# EAGLE design Base (EAGLE 9.5.2)
CNAME: WindowController; CREVISION: 0.9; DESIGNER: Bastian Teßin
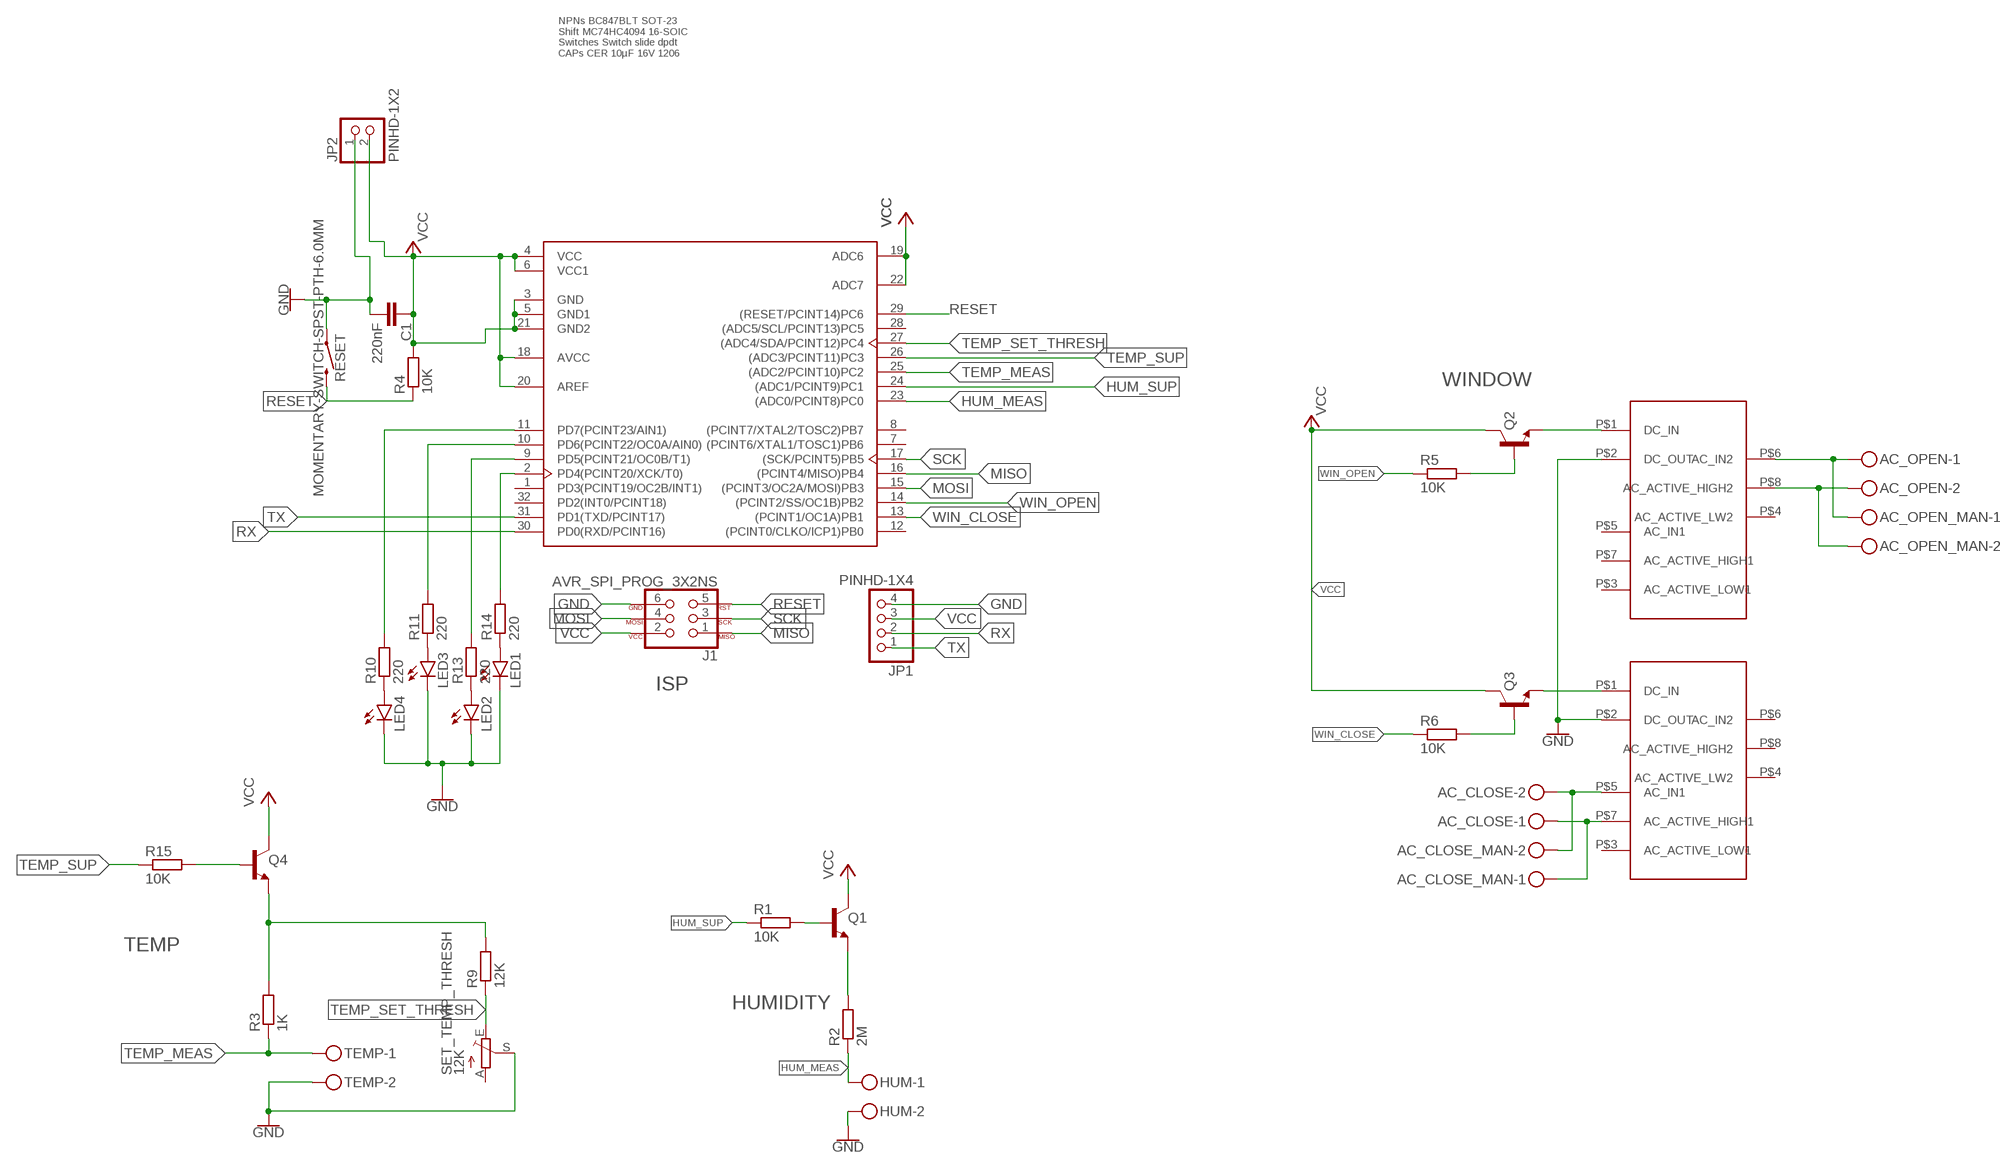
[diagram p0: schematic, sheet 1]

## Parts
AC_CLOSE  MKDSN1,5/2-5,08  [MKDSN1,5/2-5,08]
AC_CLOSE_MAN  MKDSN1,5/2-5,08  [MKDSN1,5/2-5,08]
AC_OPEN  MKDSN1,5/2-5,08  [MKDSN1,5/2-5,08]
AC_OPEN_MAN  MKDSN1,5/2-5,08  [MKDSN1,5/2-5,08]
C1  220nF  C-EUC0805  [C0805]
HUM  MKDSN1,5/2-5,08  [MKDSN1,5/2-5,08]
J1  AVR_SPI_PROG_3X2NS  [2X3-NS]
JP1  PINHD-1X4  [1X04]
JP2  PINHD-1X2  [1X02]
LED1  LEDSMT1206  [1206]
LED2  LEDSMT1206  [1206]
LED3  LEDSMT1206  [1206]
LED4  LEDSMT1206  [1206]
Q1  BD139  BC847BLT1-NPN-SOT23-BEC  [SOT23-BEC]
Q2  BD139  BC847BLT1-NPN-SOT23-BEC  [SOT23-BEC]
Q3  BD139  BC847BLT1-NPN-SOT23-BEC  [SOT23-BEC]
Q4  BD139  BC847BLT1-NPN-SOT23-BEC  [SOT23-BEC]
R1  10K  R-EU_R1206  [R1206]
R2  2M  R-EU_R1206  [R1206]
R3  1K  R-EU_R1206  [R1206]
R4  10K  R-EU_R1206  [R1206]
R5  10K  R-EU_R1206  [R1206]
R6  10K  R-EU_R1206  [R1206]
R9  12K  R-EU_R1206  [R1206]
R10  220  R-EU_R1206  [R1206]
R11  220  R-EU_R1206  [R1206]
R13  220  R-EU_R1206  [R1206]
R14  220  R-EU_R1206  [R1206]
R15  10K  R-EU_R1206  [R1206]
RESET  MOMENTARY-SWITCH-SPST-PTH-6.0MM  [TACTILE_SWITCH_PTH_6.0MM]
SET_TEMP_THRESH  12K  TRIM_EU-LI15  [LI15]
TEMP  MKDSN1,5/2-5,08  [MKDSN1,5/2-5,08]
U2  ATMEGA328P-AU  [TQFP-32]
U$1  RELAIS_EAG  [REALAIS_EAG]
U$2  RELAIS_EAG  [REALAIS_EAG]

## Nets
GND: C1.2 HUM.2 J1.6 JP1.4 JP2.1 LED1.C LED2.C LED3.C LED4.C RESET.1 SET_TEMP_THRESH.S TEMP.2 U$1.P$2(DC_OUT) U$2.P$2(DC_OUT)
HUM_MEAS: HUM.1 R2.1 U2.23((ADC0/PCINT8)PC0)
HUM_SUP: R1.1 U2.24((ADC1/PCINT9)PC1)
MISO: J1.1 U2.16((PCINT4/MISO)PB4)
MOSI: J1.4 U2.15((PCINT3/OC2A/MOSI)PB3)
N$1: Q1.B R1.2
N$2: Q1.E R2.2
N$3: AC_CLOSE.2 AC_CLOSE_MAN.2 U$2.P$5(AC_IN1)
N$4: Q2.E U$1.P$1(DC_IN)
N$6: Q3.E U$2.P$1(DC_IN)
N$7: AC_OPEN.2 AC_OPEN_MAN.2 U$1.P$8(AC_ACTIVE_HIGH2)
N$8: AC_OPEN.1 AC_OPEN_MAN.1 U$1.P$6(AC_IN2)
N$9: LED4.A R10.1
N$11: Q3.B R6.2
N$12: Q4.E R3.2 R9.2
N$13: LED3.A R11.1
N$14: AC_CLOSE.1 AC_CLOSE_MAN.1 U$2.P$7(AC_ACTIVE_HIGH1)
N$15: LED2.A R13.1
N$16: LED1.A R14.1
N$17: R14.2 U2.2(PD4(PCINT20/XCK/T0))
N$18: R13.2 U2.9(PD5(PCINT21/OC0B/T1))
N$19: R11.2 U2.10(PD6(PCINT22/OC0A/AIN0))
N$20: R10.2 U2.11(PD7(PCINT23/AIN1))
RESET: J1.5 R4.1 RESET.3 U2.29((RESET/PCINT14)PC6)
RX: JP1.2 U2.30(PD0(RXD/PCINT16))
SCK: J1.3 U2.17((SCK/PCINT5)PB5)
TEMP_MEAS: R3.1 TEMP.1 U2.25((ADC2/PCINT10)PC2)
TEMP_SET_THRESH: R9.1 SET_TEMP_THRESH.E U2.27((ADC4/SDA/PCINT12)PC4)
TEMP_SU: Q4.B R15.2
TEMP_SUP: R15.1 U2.26((ADC3/PCINT11)PC3)
TX: JP1.1 U2.31(PD1(TXD/PCINT17))
VCC: C1.1 J1.2 JP1.3 JP2.2 Q1.C Q2.C Q3.C Q4.C R4.2 U2.3(GND) U2.4(VCC) U2.5(GND1) U2.6(VCC1) U2.18(AVCC) U2.19(ADC6) U2.20(AREF) U2.21(GND2) U2.22(ADC7)
WIN_CLOSE: R6.1 U2.13((PCINT1/OC1A)PB1)
WIN_O: Q2.B R5.2
WIN_OPEN: R5.1 U2.14((PCINT2/SS/OC1B)PB2)
Unconnected: SET_TEMP_THRESH.A U2.1(PD3(PCINT19/OC2B/INT1)) U2.7((PCINT6/XTAL1/TOSC1)PB6) U2.8((PCINT7/XTAL2/TOSC2)PB7) U2.12((PCINT0/CLKO/ICP1)PB0) U2.28((ADC5/SCL/PCINT13)PC5) U2.32(PD2(INT0/PCINT18)) U$1.P$3(AC_ACTIVE_LOW1) U$1.P$4(AC_ACTIVE_LW2) U$1.P$5(AC_IN1) U$1.P$7(AC_ACTIVE_HIGH1) U$2.P$3(AC_ACTIVE_LOW1) U$2.P$4(AC_ACTIVE_LW2) U$2.P$6(AC_IN2) U$2.P$8(AC_ACTIVE_HIGH2)

## Notes on the sheet
- NPNs BC847BLT SOT-23
  Shift MC74HC4094 16-SOIC
  Switches Switch slide dpdt 
  CAPs CER 10µF 16V 1206
- WINDOW
- ISP
- TEMP
- HUMIDITY

## Library data of the parts
AC_CLOSE AC_CLOSE_MAN AC_OPEN AC_OPEN_MAN HUM TEMP = con-phoenix-508:MKDSN1,5/2-5,08: MKDSN 1,5/ 2-5,08 Printklemme Nennstrom: 13,5 A Nennspannung: 250 V Rastermaß: 5,08 mm Polzahl: 2 Anschlussart: Schraubanschluss Montage: Löten Anschlussrichtung Leiter/Platine: 0 ° Artikelnummer: 1729128 Source: http://eshop.phoenixcontact.com .. 1729128.pdf
C1 = rcl:C-EU: CAPACITOR, European symbol; SPICEPREFIX: C
J1 = SparkFun-Connectors:AVR_SPI_PROG_3X2: AVR ISP 6 Pin This is the reduced ISP connector for AVR programming. Common on Arduino. This footprint will take up less PCB space and can be used with a 10-pin to 6-pin adapter such as SKU: BOB-08508 **Special note about "TEST_POINT" package. The stop mask is on the top side, so if you want your programming test points to be on the bottom of your board, make sure to place this package on the bottom side of the board. This also ensure that the orientation to program from the bottom side will be correct. SparkFun Products: SparkFun ISP Pogo Adapter <https://www.sparkfun.com/products/11591> - NS Tiny AVR Programmer <https://www.sparkfun.com/products/11801> -PTH
JP1 = Connector:PINHD-1X4: PIN HEADER; CATEGORY: CONNECTOR; SUB-CATEGORY: PIN-HEADER
JP2 = Connector:PINHD-1X2: PIN HEADER; CATEGORY: CONNECTOR; SUB-CATEGORY: PIN-HEADER
LED1-LED4 = led:LED: LED OSRAM: - CHIPLED LG R971, LG N971, LY N971, LG Q971, LY Q971, LO R971, LY R971 LH N974, LH R974 LS Q976, LO Q976, LY Q976 LO Q996 - Hyper CHIPLED LW Q18S LB Q993, LB Q99A, LB R99A - SideLED LS A670, LO A670, LY A670, LG A670, LP A670 LB A673, LV A673, LT A673, LW A673 LH A674 LY A675 LS A676, LA A676, LO A676, LY A676, LW A676 LS A679, LY A679, LG A679 - Hyper Micro SIDELED® LS Y876, LA Y876, LO Y876, LY Y876 LT Y87S - SmartLED LW L88C, LW L88S LB L89C, LB L89S, LG L890 LS L89K, LO L89K, LY L89K LS L896, LA L896, LO L896, LY L896 - TOPLED LS T670, LO T670, LY T670, LG T670, LP T670 LSG T670, LSP T670, LSY T670, LOP T670, LYG T670 LG T671, LOG T671, LSG T671 LB T673, LV T673, LT T673, LW T673 LH T674 LS T676, LA T676, LO T676, LY T676, LB T676, LH T676, LSB T676, LW T676 LB T67C, LV T67C, LT T67C, LS T67K, LO T67K, LY T67K, LW E67C LS E67B, LA E67B, LO E67B, LY E67B, LB E67C, LV E67C, LT E67C LW T67C LS T679, LY T679, LG T679 LS T770, LO T770, LY T770, LG T770, LP T770 LB T773, LV T773, LT T773, LW T773 LH T774 LS E675, LA E675, LY E675, LS T675 LS T776, LA T776, LO T776, LY T776, LB T776 LHGB T686 LT T68C, LB T68C - Hyper Mini TOPLED® LB M676 - Mini TOPLED Santana® LG M470 LS M47K, LO M47K, LY M47K Source: http://www.osram.convergy.de LUXEON: - LUMILED® LXK2-PW12-R00, LXK2-PW12-S00, LXK2-PW14-U00, LXK2-PW14-V00 LXK2-PM12-R00, LXK2-PM12-S00, LXK2-PM14-U00 LXK2-PE12-Q00, LXK2-PE12-R00, LXK2-PE12-S00, LXK2-PE14-T00, LXK2-PE14-U00 LXK2-PB12-K00, LXK2-PB12-L00, LXK2-PB12-M00, LXK2-PB14-N00, LXK2-PB14-P00, LXK2-PB14-Q00 LXK2-PR12-L00, LXK2-PR12-M00, LXK2-PR14-Q00, LXK2-PR14-R00 LXK2-PD12-Q00, LXK2-PD12-R00, LXK2-PD12-S00 LXK2-PH12-R00, LXK2-PH12-S00 LXK2-PL12-P00, LXK2-PL12-Q00, LXK2-PL12-R00 Source: www.luxeon.com KINGBRIGHT: KA-3528ASYC Source: www.kingbright.com
Q1-Q4 = transistor:*-NPN-: NPN Transistror BF959 corrected 2008.03.06
R1-R6 R9-R11 R13-R15 = rcl:R-EU_: RESISTOR, European symbol; SPICEPREFIX: R
RESET = SparkFun-Switches:MOMENTARY-SWITCH-SPST: Momentary Switch (Pushbutton) - SPST Normally-open (NO) SPST momentary switches (buttons, pushbuttons). Variants PTH-12MM - 12mm square, through-hole Momentary Pushbutton Switch - 12mm Square <https://www.sparkfun.com/products/9190> (COM-09190) PTH-6.0MM, PTH-6.0MM-KIT - 6.0mm square, through-hole Mini Pushbutton Switch <https://www.sparkfun.com/products/97> (COM-00097) KIT package intended for soldering kit's - only one side of pads' copper is exposed. PTH-RIGHT-ANGLE-KIT - Right-angle, through-hole Right Angle Tactile Button <https://www.sparkfun.com/products/10791> - Used on SparkFun BigTime Watch Kit <https://www.sparkfun.com/products/11734> SMD-12MM - 12mm square, surface-mount Tactile Button - SMD (12mm) <https://www.sparkfun.com/products/12993> (COM-12993) Used on SparkFun PicoBoard <https://www.sparkfun.com/products/11888> SMD-4.5MM - 4.5mm Square Trackball Switch Used on SparkFun Blackberry Trackballer Breakout <https://www.sparkfun.com/products/13169> SMD-4.6MMX2.8MM - 4.60mm x 2.80mm, surface mount Used on SparkFun SAMD21 Mini Breakout <https://www.sparkfun.com/products/13664> SMD-5.2MM, SMD-5.2-REDUNDANT - 5.2mm square, surface-mount Mini Pushbutton Switch - SMD <https://www.sparkfun.com/products/8720> (COM-08720) Used on Arduino Pro Mini <https://www.sparkfun.com/products/11114> REDUNDANT package connects both switch circuits together SMD-6.0X3.5MM - 6.0 x 3.5mm, surface mount Momentary Reset Switch SMD <https://www.sparkfun.com/products/8229> (COM-08229) SMD-6.2MM-TALL - 6.2mm square, surface mount Tactile Button - SMD (6mm) <https://www.sparkfun.com/products/12992> Used on SparkFun Digital Sandbox <https://www.sparkfun.com/products/12651> SMD-RIGHT-ANGLE - Right-angle, surface mount Used on SparkFun Block for Intel® Edison - Arduino <https://www.sparkfun.com/products/13036>; PROD_ID: SWCH-08441; SF_SKU: COM-00097
SET_TEMP_THRESH = pot:TRIM_EU-: POTENTIOMETER
U2 = Microcontroller:ATMEGA328P-AU: IC MCU 8BIT 32KB FLASH 32TQFP Manufacturer's datasheet <http://ww1.microchip.com/downloads/en/DeviceDoc/ATmega48A-PA-88A-PA-168A-PA-328-P-DS-DS40002061A.pdf>; CREATED_BY: PCBLayout.com; DIGIKEY_PART_NUMBER: ATMEGA328P-AU-ND; MANUFACTURER: Microchip Technology; MPN: ATMEGA328P-AU; PACKAGE: TQFP-32
U$1 U$2 = EAG_RELAIS:RELAIS_EAG

## Board
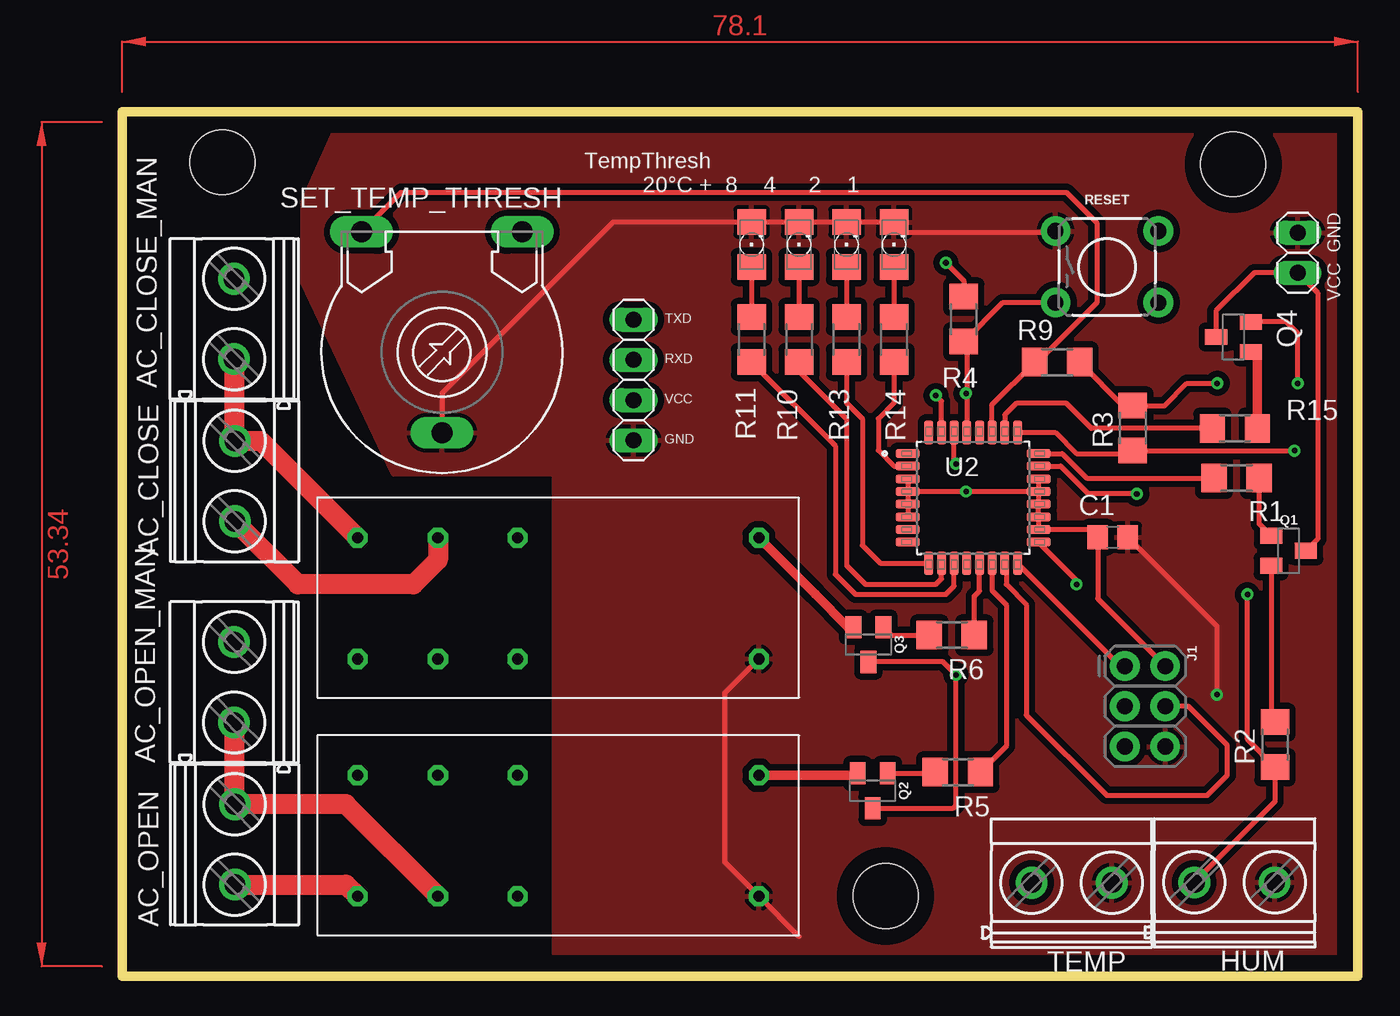
[diagram p1: board, top side]
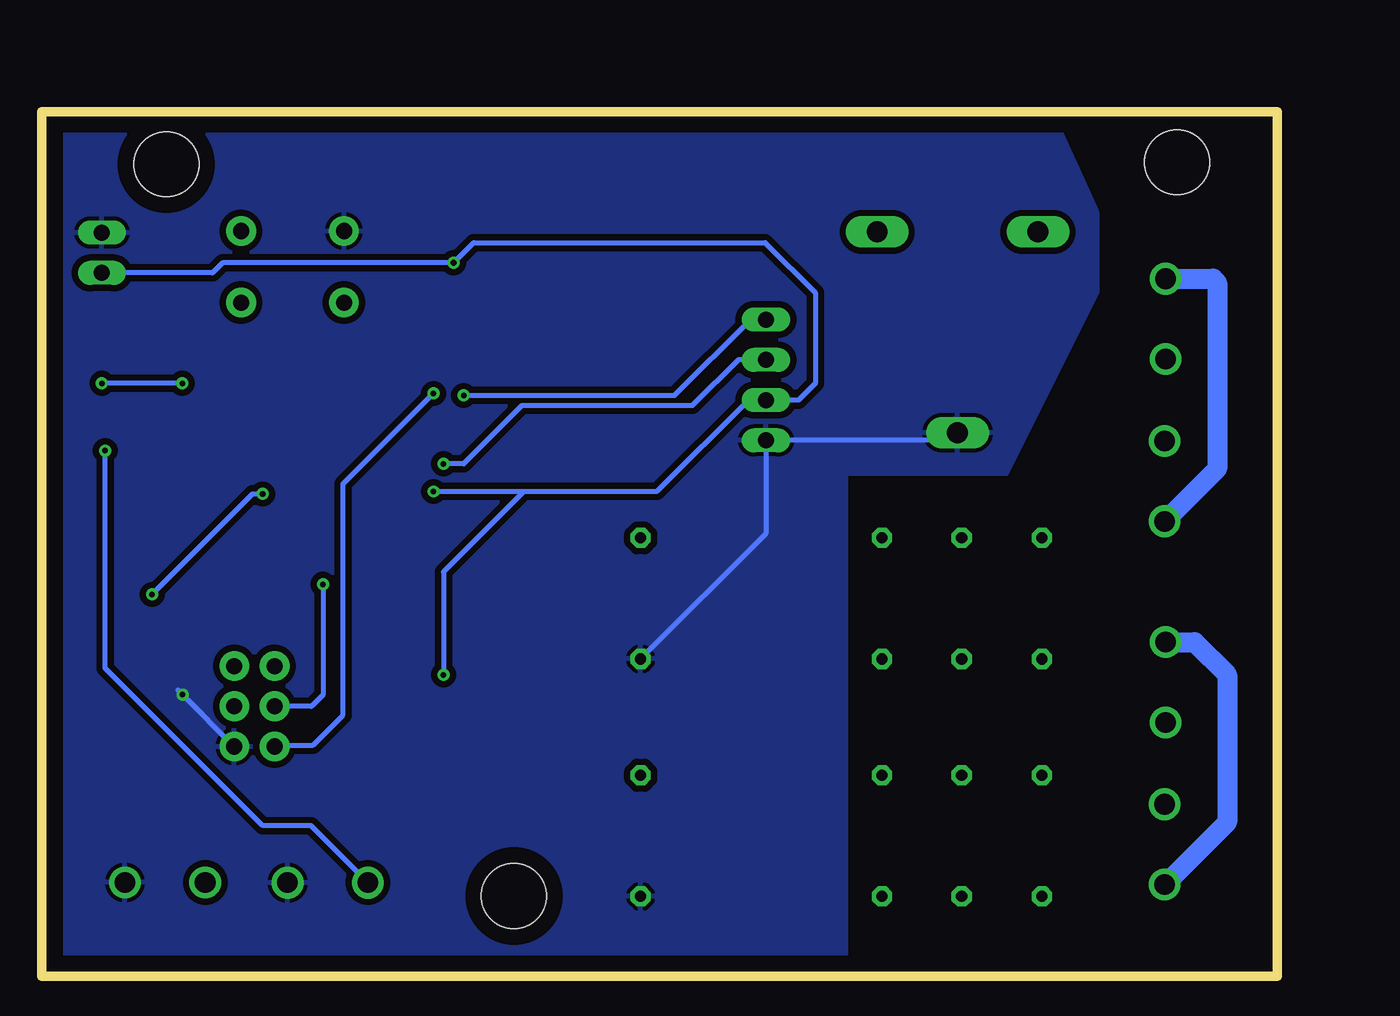
[diagram p2: board, bottom side, seen from below]

Size 78.1 x 54.61 mm. Coordinates in mm from the lower left corner, seen from the top.
Outline: 78.1,0 0,0 0,54.61 78.1,54.61 78.1,0
Copper layers (1*16): Top 0.035mm / dielectric 0.15mm / Bottom 0.035mm
Design rules "default": minimum track width 6mil, minimum drill 0.35mm, track to track 6mil, track to pad 6mil, pad to pad 6mil, via to via 6mil, smd to smd 6mil, copper to edge 40mil, drill to drill 6mil, minimum pad ring 10mil, minimum via ring 8mil, stop-mask expansion 4mil, vias tented up to drill 0mil, thermal gap 10mil
Holes 4.1 mm at 6.35,51.44 70.23,51.31 48.26,5.08

### Footprints (pad centres in the part's own frame; a part is rotated, then mirrored left to right if it is on the bottom)
MKDSN1,5/2-5,08 = drill 1.3 pad 2: 1 -2.561,0.025; 2 2.519,0.025
C0805 = smd 1.3 x 1.5: 1 -0.95,0; 2 0.95,0
2X3-NS = drill 1.016 pad 1.88: 1 -2.54,-1.27; 2 -2.54,1.27; 3 0,-1.27; 4 0,1.27; 5 2.54,-1.27; 6 2.54,1.27
1X04 = drill 1.016 long: 1 -3.81,0; 2 -1.27,0; 3 1.27,0; 4 3.81,0
1X02 = drill 1.016 long: 1 -1.27,0; 2 1.27,0
1206 = smd 1.6 x 1.803: A -1.422,0; C 1.422,0
SOT23-BEC = smd 1 x 1.4: B -0.95,-1.1; C 0,1.1; E 0.95,-1.1
R1206 = smd 1.6 x 1.803: 1 -1.422,0; 2 1.422,0
TACTILE_SWITCH_PTH_6.0MM = drill 1.016 pad 1.88: 1 -3.251,2.261; 2 3.251,2.261; 3 -3.251,-2.261; 4 3.251,-2.261
LI15 = drill 1.321 long: A -5.08,-7.62; E 5.08,-7.62; S 0,5.08
TQFP-32 = smd 0.57 x 1.5: 1 -2.8,-4.13; 2 -2,-4.13; 3 -1.2,-4.13; 4 -0.4,-4.13; 5 0.4,-4.13; 6 1.2,-4.13; 7 2,-4.13; 8 2.8,-4.13; 17 2.8,4.13; 18 2,4.13; 19 1.2,4.13; 20 0.4,4.13; 21 -0.4,4.13; 22 -1.2,4.13; 23 -2,4.13; 24 -2.8,4.13 | smd 1.5 x 0.57: 9 4.13,-2.8; 10 4.13,-2; 11 4.13,-1.2; 12 4.13,-0.4; 13 4.13,0.4; 14 4.13,1.2; 15 4.13,2; 16 4.13,2.8; 25 -4.13,2.8; 26 -4.13,2; 27 -4.13,1.2; 28 -4.13,0.4; 29 -4.13,-0.4; 30 -4.13,-1.2; 31 -4.13,-2; 32 -4.13,-2.8
REALAIS_EAG = drill 0.7 pad 1.27 octagon: P$1 2.546,2.527; P$2 2.546,10.181; P$3 17.8,2.527; P$4 17.8,10.181; P$5 22.827,2.527; P$6 22.827,10.181; P$7 27.908,2.527; P$8 27.908,10.181

### Placement (x,y rotation side)
AC_CLOSE  7.11,31.27 270 top
AC_CLOSE_MAN  7.11,41.56 90 top
AC_OPEN  7.11,8.32 270 top
AC_OPEN_MAN  7.11,18.6 90 top
C1  62.61,27.75 0 top
HUM  70.33,5.92 0 top
J1  64.65,17.06 270 top
JP1  32.33,37.68 270 top
JP2  74.29,45.72 270 top
LED1  48.79,46.24 90 top
LED2  45.79,46.24 90 top
LED3  42.79,46.24 90 top
LED4  39.79,46.24 90 top
Q1  73.72,26.88 270 top
Q2  47.44,11.73 180 top
Q3  47.17,20.97 180 top
Q4  70.24,40.4 90 top
R1  70.44,31.49 0 top
R2  72.87,14.65 90 top
R3  63.88,34.65 90 top
R4  53.2,41.52 90 top
R5  52.82,12.9 180 top
R6  52.44,21.57 180 top
R9  59.1,38.81 0 top
R10  39.79,40.24 270 top
R11  42.79,40.24 270 top
R13  45.79,40.24 270 top
R14  48.79,40.24 270 top
R15  70.33,34.62 0 top
RESET  62.25,44.83 0 top
SET_TEMP_THRESH  20.22,39.42 180 top
TEMP  60.04,5.9 0 top
U2  53.79,30.24 270 top
U$1  42.79,15.24 180 top
U$2  42.79,30.24 180 top

### Tracks (layer width: path | path; a pad name or v marks a point on that pad's centre or on a via)
GND  (via drill 0.35)
  Top 0.305: U$2.P$2 38.1,17.91 38.1,7.2 U$1.P$2 42.78,2.51 | 58.93,47.02 49.43,47.02 LED1.C LED2.C LED3.C LED4.C | LED4.C 39.12,46.99 | C1.2 69.2,22.11 v69.2,17.8 | LED4.C 31.03,47.66 20.22,36.84 SET_TEMP_THRESH.S
  Bottom 0.305: J1.6 v69.2,17.8 69.49,18.09 | SET_TEMP_THRESH.S 20.69,33.87 JP1.4 32.33,27.97 U$2.P$2
  pour Top (isolate 0.406): 79.38,54.61 13.97,54.61 11.43,48.9 11.43,43.82 17.14,31.75 27.3,31.75 27.3,-1.27 79.38,-1.27
  pour Bottom (isolate 0.406): 80,55.25 14.6,55.25 11.43,48.26 11.43,43.18 17.14,31.75 27.3,31.75 27.3,-1.27 79.37,-1.27
HUM_MEAS  (via drill 0.35)
  Top 0.305: U2.23 59.33,32.24 61.09,30.48 v64.13,30.48 | v71.12,24.13 71.12,14.97 R2.1 72.87,11.04 HUM.1
  Bottom 0.305: v71.12,24.13 64.77,30.48 v64.13,30.48
HUM_SUP
  Top 0.305: U2.24 59.42,33.04 60.97,31.49 R1.1
MISO
  Top 0.305: U2.16 63.09,19.6 J1.1
MOSI
  Top 0.305: U2.15 55.88,26.02 55.88,24.77 57.15,23.5 57.15,16.51 62.23,11.43 68.58,11.43 69.85,12.7 69.85,14.61 67.39,17.06 J1.4
N$1
  Top 0.305: Q1.B 71.86,28.59 R1.2
N$2
  Top 0.305: Q1.E 72.62,16.31 R2.2
N$3
  Top 1.27: 6.95,28.58 AC_CLOSE.2 11.12,24.77 18.41,24.77 19.96,26.31 U$2.P$5
  Bottom 1.27: AC_CLOSE_MAN.2 4.07,44.08 3.81,43.82 3.81,32.07 AC_CLOSE.2
N$4
  Top 0.61: U$1.P$1 46.37,12.71 Q2.E
N$6
  Top 0.61: U$2.P$1 43.82,24.13 45.89,22.07 Q3.E
N$7
  Top 1.27: 7.05,5.72 AC_OPEN.2 14.14,5.8 U$1.P$8
  Bottom 1.27: AC_OPEN_MAN.2 5.25,21.12 3.17,19.05 3.17,9.75 AC_OPEN.2
N$8
  Top 1.27: U$1.P$6 14.14,10.88 AC_OPEN.1 7.08,10.93 AC_OPEN_MAN.1
N$9
  Top 0.305: LED4.A R10.1
N$11
  Top 0.305: Q3.B 48.62,21.57 R6.2
N$12  (via drill 0.35)
  Top 0.305: R9.2 63.26,36.07 R3.2 65.91,36.07 67.31,37.47 v69.22,37.47 | v74.29,37.47 74.29,40.64 73.59,41.35 Q4.E
  Bottom 0.305: v69.22,37.47 v74.29,37.47
N$13
  Top 0.305: LED3.A R11.1
N$14
  Top 1.27: AC_CLOSE_MAN.1 7.08,33.88 AC_CLOSE.1 8.76,33.83 U$2.P$7
N$15
  Top 0.305: LED2.A R13.1
N$16
  Top 0.305: LED1.A R14.1
N$17
  Top 0.305: R14.2 48.79,36.24 47.79,35.24 47.79,33.24 48.79,32.24 U2.2
N$18
  Top 0.305: R13.2 45.79,36.24 46.79,35.24 46.79,27.24 47.92,26.11 U2.9
N$19
  Top 0.305: R11.2 42.79,38.24 45.79,35.24 45.79,25.97 46.99,24.77 51.43,24.77 51.79,25.12 U2.10
N$20
  Top 0.305: R10.2 45.09,33.52 45.09,25.4 46.35,24.13 52.07,24.13 52.59,24.65 U2.11
RESET  (via drill 0.35)
  Top 0.305: 53.39,36.78 53.39,39.91 R4.1 55.64,42.55 58.97,42.55 RESET.3 | v53.34,36.83 53.39,36.78 | 53.39,36.78 U2.29
  Bottom 0.305: J1.5 63.3,14.61 60.96,14.61 59.05,16.51 59.05,31.12 v53.34,36.83
RX  (via drill 0.35)
  Top 0.305: v52.71,32.39 52.59,32.5 U2.30
  Bottom 0.305: v52.71,32.39 51.43,32.39 47.75,36.07 36.96,36.07 34.07,38.95 JP1.2
SCK  (via drill 0.35)
  Top 0.305: U2.17 60.32,25.03 v60.32,24.77
  Bottom 0.305: v60.32,24.77 60.32,17.78 61.04,17.06 J1.3
TEMP_MEAS  (via drill 0.35)
  Top 0.305: U2.25 58.98,34.37 60.32,33.02 63.68,33.02 R3.1 v74.09,33.22
  Bottom 0.305: TEMP.1 61.08,9.53 64.13,9.53 74.09,19.48 v74.09,33.22
TEMP_SET_THRESH
  Top 0.305: U2.27 54.99,36.12 R9.1 57.85,38.81 61.6,42.55 61.6,47.62 59.69,49.53 17.63,49.53 SET_TEMP_THRESH.E
TEMP_SU
  Top 0.61: Q4.B 71.75,39.03 R15.2
TEMP_SUP
  Top 0.305: R15.1 61.26,34.62 59.69,36.2 56.51,36.2 55.79,35.47 U2.26
TX  (via drill 0.35)
  Top 0.305: U2.31 51.79,36.35 v51.43,36.7
  Bottom 0.305: v51.43,36.7 38.1,36.7 33.35,41.46 32.36,41.46 JP1.1
VCC  (via drill 0.35)
  Top 0.305: U2.3 U2.4 | U2.4 U2.5 U2.6 | U2.4 v53.34,30.64 U2.21 | U2.21 U2.20 | U2.20 | 74.93,26.78 Q1.C 75.56,27.63 75.56,43.18 JP2.2 71.54,44.45 69.14,42.05 Q4.C | J1.2 61.66,23.87 C1.1 61.17,28.24 U2.18 U2.19 U2.20 | v52.07,45.09 53.2,43.96 R4.2 | Q2.C 52.54,10.63 52.71,10.8 v52.71,19.05 51.89,19.87 Q3.C | U2.22 U2.21
  Bottom 0.305: v53.34,30.64 47.62,30.64 | 47.62,30.64 39.21,30.64 33.44,36.41 JP1.3 30.27,36.41 29.21,37.47 29.21,43.18 32.38,46.36 50.8,46.36 v52.07,45.09 66.68,45.09 67.31,44.45 JP2.2 | 47.62,30.64 52.71,25.56 v52.71,19.05
WIN_CLOSE
  Top 0.305: R6.1 53.86,24.02 54.19,24.35 U2.13
WIN_O
  Top 0.305: Q2.B 51.32,12.83 R5.2
WIN_OPEN
  Top 0.305: U2.14 54.99,24.39 55.88,23.5 55.88,14.54 R5.1
(copper drawn outside any net)
  shapes: Top area x2

### Text on the board
tNames: TempThresh / 20°C + 8 4 2 1 | GND | VCC | TXD | RXD | VCC | GND